# Altium schematic sheet accelerometer.SchDoc: Fault-Tolerant Quadcopter
size A; DrawnBy: Vaughn Kottler; Engineer: Vaughn Kottler; Revision: A
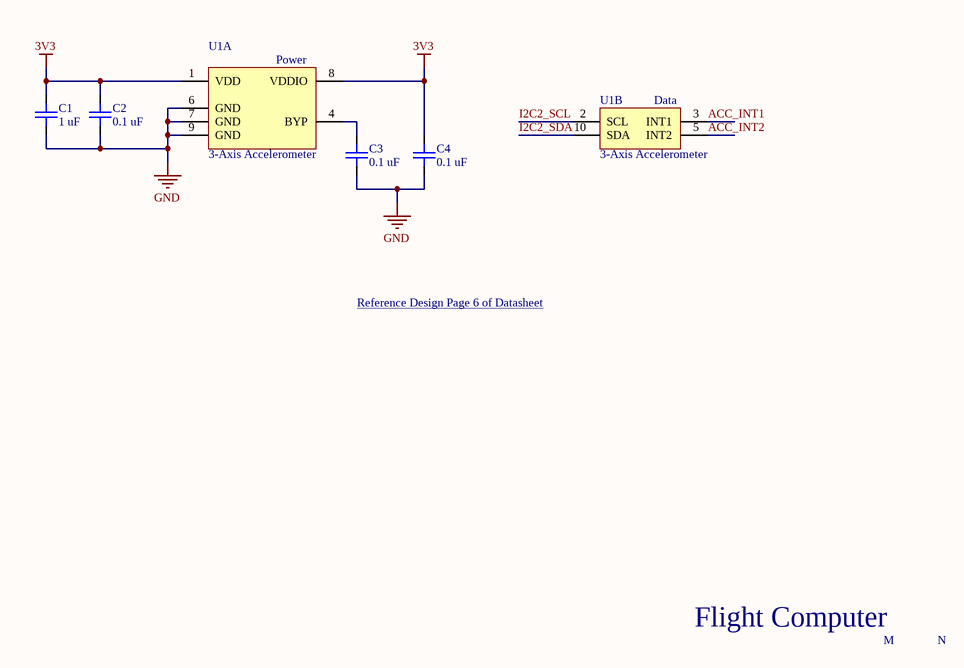
[diagram p0: accelerometer.SchDoc]

## Parts
C1  1 uF  [CAP-CER-0805-TALL]
C2  0.1 uF  [CAP-CER-0805-SHORT]
C3  0.1 uF  [CAP-CER-0805-SHORT]
C4  0.1 uF  [CAP-CER-0805-SHORT]
U1  3-Axis Accelerometer  [SON10]  (parts A,B of 2)

## Nets
3V3: C1.2 C2.2 C4.2 U1.1(VDD) U1.8(VDDIO)
GND: C1.1 C2.1 C3.1 C4.1 U1.6(GND) U1.7(GND) U1.9(GND)
ACC_INT1: U1.3(INT1)
ACC_INT2: U1.5(INT2)
I2C2_SCL: U1.2(SCL)
I2C2_SDA: U1.10(SDA)
NetC3_2: C3.2 U1.4(BYP)

## Notes on the sheet
- Reference Design Page 6 of Datasheet <https://media.digikey.com/pdf/Data%20Sheets/NXP%20PDFs/MMA8652FC.pdf>
- Flight Computer
- M
- N
- (in symbol MMA8652FC, part A) Power
- (in symbol MMA8652FC, part B) Data

## Library data of the parts
C1 = CAP-CER-1uF-10V: 10%, 0805; ComponentLink1Description: Capacitor Book (Amazon); ComponentLink1URL: https://www.amazon.com/gp/product/B0728HBDRW/
C2-C4 = CAP-CER-0.1uF-25V: 10%, 0805; ComponentLink1Description: Capacitor Book (Amazon); ComponentLink1URL: https://www.amazon.com/gp/product/B0728HBDRW/
U1 = MMA8652FC: 3-Axis, 12-bit Digital Accelerometer, I2C 400kHz; ComponentLink1Description: Datasheet; ComponentLink1URL: https://media.digikey.com/pdf/Data%20Sheets/NXP%20PDFs/MMA8652FC.pdf; Supplier 1: Digi-Key; Supplier Part Number 1: MMA8652FCR1DKR-ND